# Altium schematic sheet PCIE_X1_36PIN_1.SchDoc
size A3; SheetNumber: 0; SheetTotal: 0
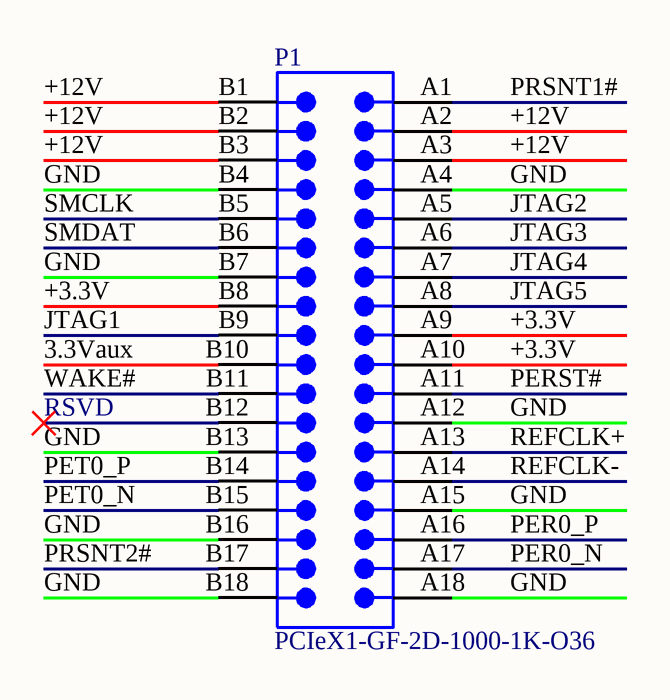
[diagram p0: PCIE_X1_36PIN_1.SchDoc]

## Parts
P1  PCIeX1-GF-2D-1000-1K-O36  [PCIeX1-GF-2D-1000-1K-O36]  (no BOM)

## Nets
3.3Vaux: P1.B10
+3.3V: P1.A9 P1.A10 P1.B8
+12V: P1.A2 P1.A3 P1.B1 P1.B2 P1.B3
GND: P1.A4 P1.A12 P1.A15 P1.A18 P1.B4 P1.B7 P1.B13 P1.B16 P1.B18
JTAG1: P1.B9
JTAG2: P1.A5
JTAG3: P1.A6
JTAG4: P1.A7
JTAG5: P1.A8
PER0_N: P1.A17
PER0_P: P1.A16
PERST#: P1.A11
PET0_N: P1.B15
PET0_P: P1.B14
PRSNT1#: P1.A1
PRSNT2#: P1.B17
REFCLK+: P1.A13
REFCLK-: P1.A14
SMCLK: P1.B5
SMDAT: P1.B6
WAKE#: P1.B11

Not connected (* = marked no-connect by the designer): P1 B12*

## Notes on the sheet
- RSVD
- Title
- Size:
- Date:
- A3
- Number:
- Time:
- Revision:
- Sheet
- of
- File:

## Library data of the parts
P1 = CMP-0001-00030-2: Golden finger, PCIeX1, Dual, Opposite, Pitch 1mm, 36-Position; Mating Connector: Molex-87715-9006; Package Reference: PCIeX1-GF-2D-1000-1K-O36; ClassName: Edge Connector; Publisher: Altium; Datasheet Version: rev2.0, Apr-2007